# EasyEDA Pro project ADA4530_2025-03-15.epro, board PCB5
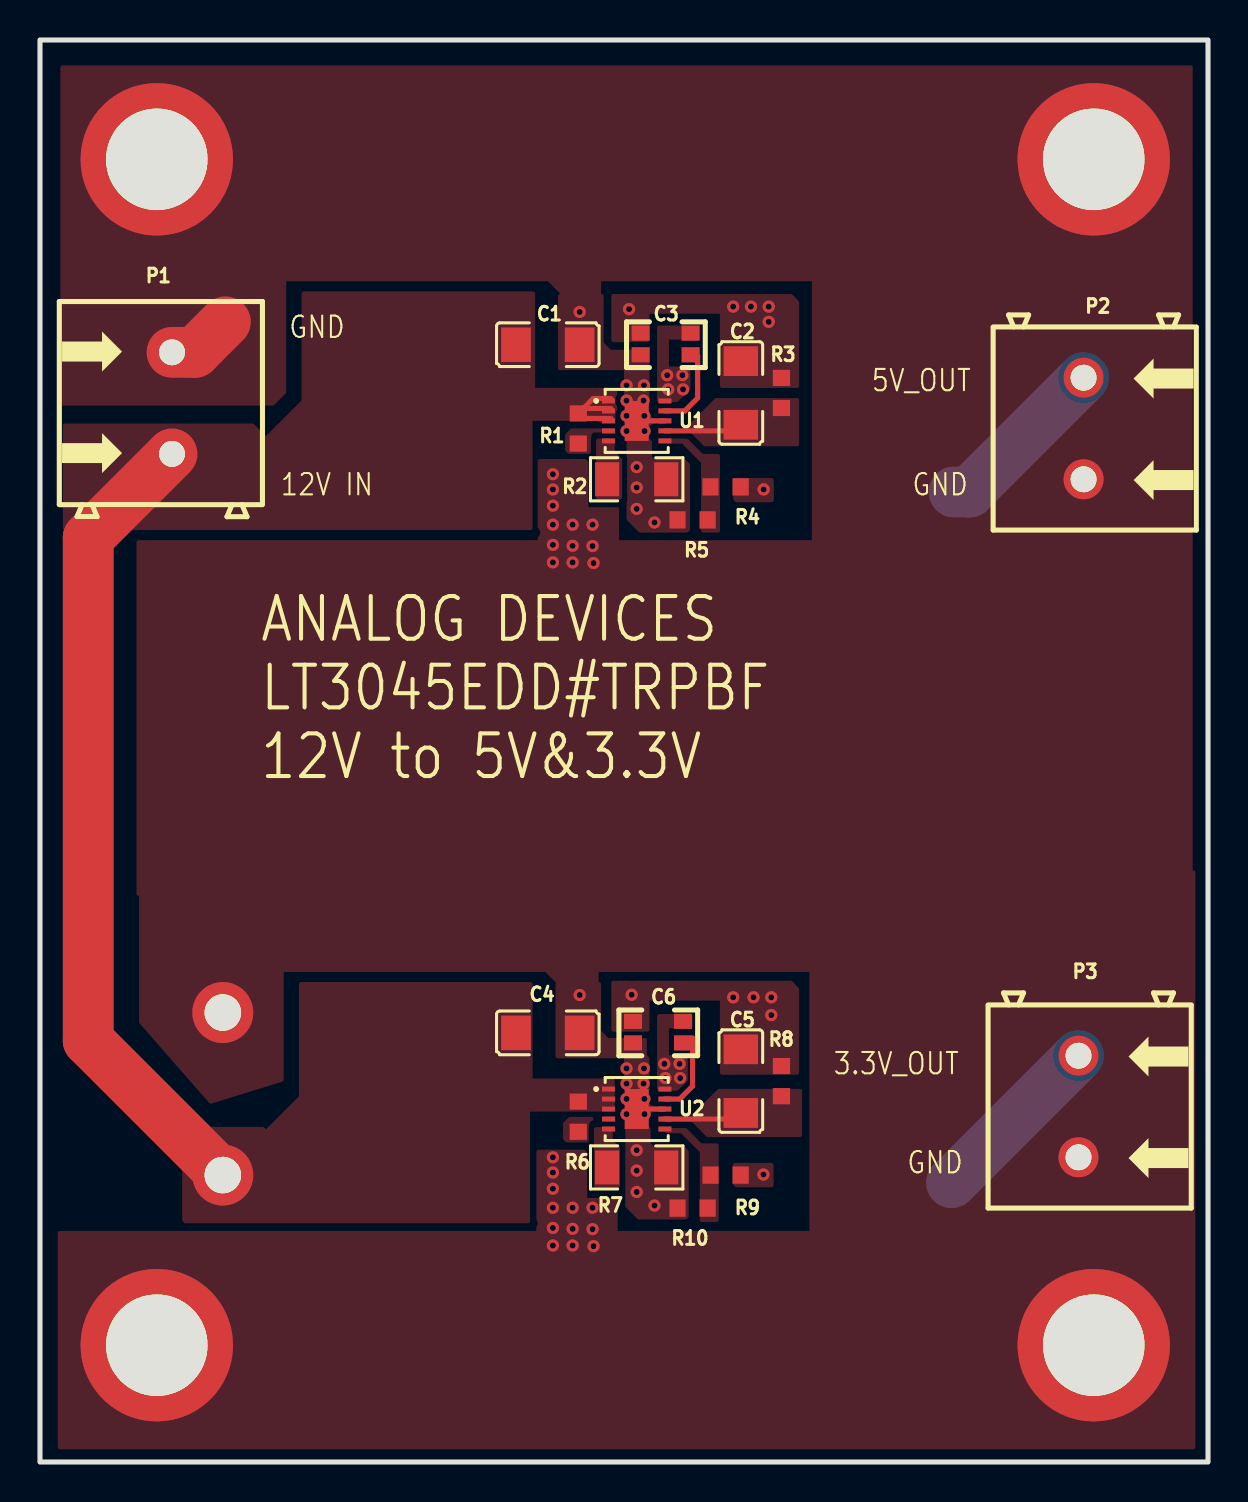
[diagram p6: board, top side]
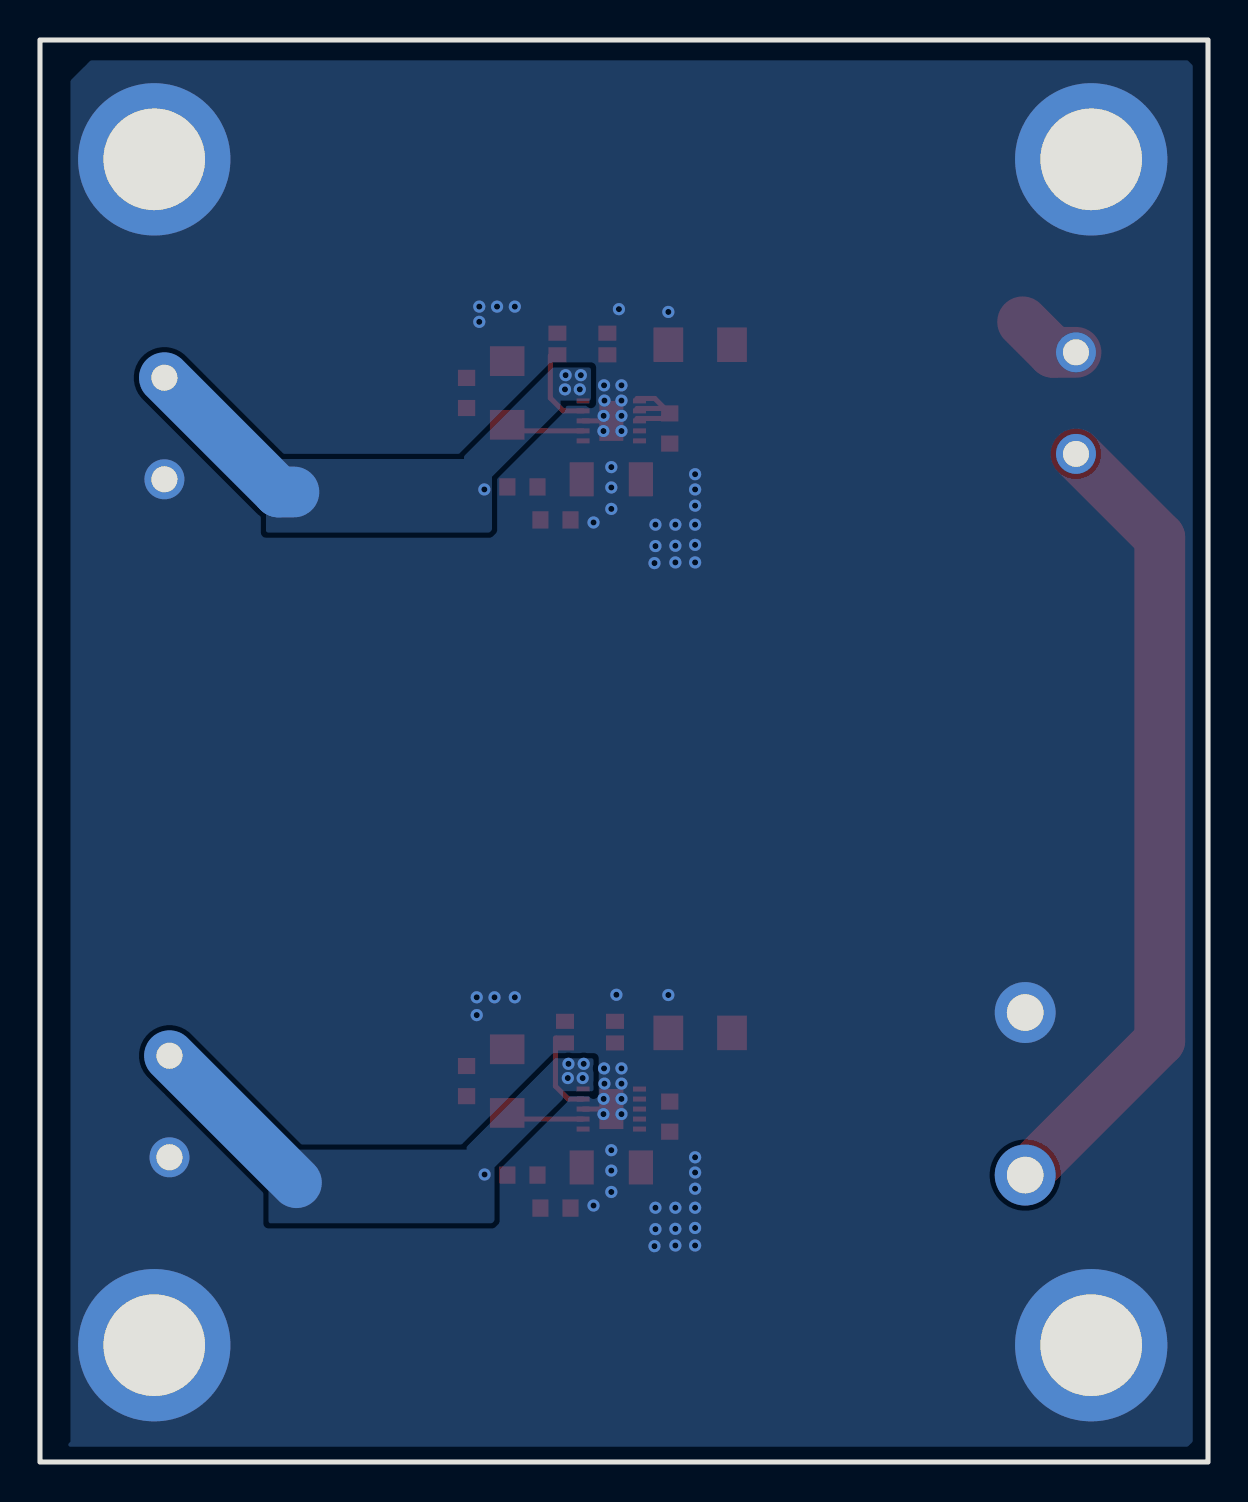
[diagram p7: board, bottom side, seen from below]

Outline 58.42 x 71.12 mm; copper layers: Top Layer, Bottom Layer. Coordinates in mm from the lower left corner of the outline.
Outline path: rectangle 0,71.12 58.42,0
Stack: Top Layer 0.035mm / Dielectric1 1.51mm FR4 er 4.5 / Bottom Layer 0.035mm

## Design rules (mm)
template: 自定义配置
spacing copperThickness1oz (default): track to track 0.102, other pairs 0.152 to 0.3
spacing copperThickness2oz: track to track 0.203, other pairs 0.152 to 0.3
track width copperThickness1oz (default): min 0.127, default 0.254, max 2.54
track width copperThickness2oz: min 0.203, default 0.254, max 2.54
differential pair differentialPair (default): width min 0.127, default 0.254, max 2.54; gap min 0.152, default 0.152
via viaSize (default): diameter min 0.5, default 0.61, max 10; hole min 0.3, default 0.305, max 6.3
net VCC uses 全连接
net GND uses 全连接
net $2N366 uses 全连接
net $2N1218 uses 全连接
net DVDD uses 全连接
net $2N511 uses 全连接
net $2N1220 uses 全连接
net $2N1217 uses 全连接
net $2N394 uses 全连接
net $2N1221 uses 全连接
net $2N525 uses 全连接
net AVDD uses 全连接

## Placement (name value [footprint] x y rotation side)
C1  4.7uF  [C1206]  25.4 55.88 180 top
C2  4.7uF  [C1206]  35.05 53.47 270 top
C3  10uF  [4line-capacitance]  29.59 54.99 0 top
C4  4.7uF  [C1206]  25.4 21.46 180 top
C5  4.7uF  [C1206]  35.05 19.05 270 top
C6  10uF  [4line-capacitance]  29.21 20.57 0 top
NOREF  -  [Pad_e417]  9.14 22.48 0 top
NOREF#2  -  [Pad_e21]  5.84 65.15 0 top
NOREF#3  -  [Pad_e31]  52.7 65.15 0 top
NOREF#4  -  [Pad_e33]  52.7 5.84 0 top
NOREF#5  -  [Pad_e418]  9.14 14.35 0 top
NOREF#6  -  [Pad_e32]  5.84 5.84 0 top
P1  WJ500V-5.08-2P  [CONN-TH_2P-P5.00_WJ500V-5.08-2P]  6.6 52.96 90 top
P2  WJ500V-5.08-2P  [CONN-TH_2P-P5.00_WJ500V-5.08-2P]  52.2 51.69 270 top
P3  WJ500V-5.08-2P  [CONN-TH_2P-P5.00_WJ500V-5.08-2P]  51.94 17.78 270 top
R1  200kΩ  [R0603]  26.92 51.69 90 top
R2  750Ω  [R1206]  29.85 49.15 180 top
R3  33.2kΩ  [R0603]  37.08 53.47 270 top
R4  453kΩ  [R0603]  34.29 48.77 0 top
R5  49.9kΩ  [R0603]  32.64 47.12 0 top
R6  200kΩ  [R0603]  26.92 17.27 90 top
R7  750Ω  [R1206]  29.85 14.73 180 top
R8  49.9kΩ  [R0603]  37.08 19.05 270 top
R9  453kΩ  [R0603]  34.29 14.35 0 top
R10  49.9kΩ  [R0603]  32.64 12.7 0 top
U1  LT3045EDD#TRPBF  [DFN-10_L3.0-W3.0-P0.50-BL-EP]  29.85 52.07 270 top
U2  LT3045EDD#TRPBF  [DFN-10_L3.0-W3.0-P0.50-BL-EP]  29.85 17.65 270 top

## Footprints (pads in the part's own frame, mm; a bottom-side part is the same pattern mirrored in y, then rotated)
4line-capacitance
  rect 0.9x0.754 smd: 1(0.45,1.466) 1(0.45,0.385) 2(2.95,1.466) 2(2.95,0.385)
C1206
  rect 1.485x1.728 smd: 1(-1.593,0) 2(1.593,0)
CONN-TH_2P-P5.00_WJ500V-5.08-2P
  round 2 hole 1.3: 1(-2.54,0) 2(2.54,0)
DFN-10_L3.0-W3.0-P0.50-BL-EP
  rect 0.25x0.65 smd: 1(-1,-1.411) 2(-0.5,-1.411) 3(0,-1.411) 4(0.5,-1.411) 5(1,-1.411) 6(1,1.411) 7(0.5,1.411) 8(0,1.411) 9(-0.5,1.411) 10(-1,1.411)
  rect 2x1.2 smd: 11(0,0)
Pad_e21
  round 7.62 hole 5.08: 1(0,0)
Pad_e31
  round 7.62 hole 5.08: 1(0,0)
Pad_e32
  round 7.62 hole 5.08: 1(0,0)
Pad_e33
  round 7.62 hole 5.08: 1(0,0)
Pad_e417
  round 3.048 hole 1.829: 1(0,0)
Pad_e418
  round 3.048 hole 1.829: 1(0,0)
R0603
  rect 0.806x0.864 smd: 1(-0.753,0) 2(0.753,0)
R1206
  rect 1.208x1.701 smd: 1(-1.479,0) 2(1.479,0)

## Nets
As in the schematic, except:
GND: C1.1 C2.1 C3.1 C4.1 C5.1 C6.1 NOREF.1 NOREF#2.1 NOREF#3.1 NOREF#4.1 NOREF#6.1 P1.2 P2.2 P3.2 R2.1 R3.1 R5.1 R7.1 R8.1 R10.1 U1.8 U1.11 U2.8 U2.11
VCC: C1.2 C4.2 NOREF#5.1 P1.1 R1.2 R6.2 U1.1 U1.2 U1.3 U2.1 U2.2 U2.3

## Via types
v1: diameter 0.61, hole 0.305, Top Layer to Bottom Layer, 70 vias

## Routing (per net, layer and track width the routed paths; a pad name or vN(x,y) marks a point on that pad's centre or on a via; arc(x,y) is an arc through that point)
AVDD: length 13
  Top Layer w0.254: 32.64,21.21 32.64,18.8 32,18.15 U2.9
  Bottom Layer w2.54: 45.59,13.97 51.94,20.32
  vias: v1(31.23,19.91) v1(31.28,19.2) v1(31.99,19.91) v1(32.02,19.2) v1(36.18,14.38)
DVDD: length 13.2
  Top Layer w0.254: C3.2 32.83,55.38 32.89,55.31 32.89,53.21 32.25,52.57 U1.9
  Bottom Layer w2.54: 45.72,48.51 46.48,48.51 P2.1
  vias: v1(31.37,54.36) v1(31.42,53.65) v1(32.13,54.36) v1(32.16,53.65) v1(36.2,48.64)
GND: length 6.1
  Top Layer w0.254: U1.11 U1.8 ; U2.8 U2.11
  Top Layer w2.54: P1.2 7.75,55.5 9.27,57.02
  vias: v1(25.65,49.4) v1(25.65,48.64) v1(25.65,47.83) v1(25.65,46.88) v1(25.65,45.87) v1(25.65,44.99) v1(25.65,15.24) v1(25.65,14.48) v1(25.65,13.67) v1(25.65,12.72) v1(25.65,11.71) v1(25.65,10.83) v1(26.64,46.88) v1(26.64,45.82) v1(26.64,44.99) v1(26.64,12.72) v1(26.64,11.66) v1(26.64,10.83) v1(26.99,57.52) v1(26.99,23.36) v1(27.64,46.88) v1(27.64,45.81) v1(27.69,44.96) v1(27.64,12.72) v1(27.64,11.65) v1(27.69,10.8) v1(29.34,53.85) v1(29.34,53.09) v1(29.34,52.32) v1(29.34,51.56) v1(29.34,19.69) v1(29.34,18.92) v1(29.34,18.16) v1(29.34,17.4) v1(29.46,57.66) v1(29.59,23.37) v1(29.85,49.76) v1(29.85,48.74) v1(29.85,47.67) v1(29.85,15.6) v1(29.85,14.58) v1(29.85,13.51) v1(30.21,53.85) v1(30.19,53.09) v1(30.21,19.69) v1(30.19,18.92) v1(30.23,52.32) v1(30.24,51.56) v1(30.23,18.16) v1(30.24,17.4) v1(30.73,46.99) v1(30.73,12.83) v1(34.67,57.79) v1(34.67,23.24) v1(35.56,57.79) v1(35.69,23.24) v1(36.45,57.79) v1(36.45,57.02) v1(36.58,23.24) v1(36.58,22.35)
VCC: length 45.7
  Top Layer w0.254: 27.18,52.7 27.19,52.69 28.56,52.69 ; 27.18,52.7 R1.2 27.17,52.19 28.56,52.19 ; 27.18,52.7 27.67,53.19 28.56,53.19
  Top Layer w2.54: NOREF#5.1 2.41,21.08 2.41,46.23 P1.1
$2N366: length 3.9
  Top Layer w0.254: U1.7 34.75,51.57 C2.2
$2N1218: length 3.9
  Top Layer w0.254: U2.7 34.75,17.15 C5.2

## Copper pours and planes (outline as drawn; the poured copper is in the pictures)
AVDD on Top Layer: 30.86,18.57 31.88,18.57 32.4,19.07 32.4,20.35 31.46,20.35 31.46,21.69 32.64,21.69 32.64,22.4 30.86,22.4
AVDD on Top Layer: 34.67,14.96 36.62,14.96 36.69,14.89 36.69,13.75 34.79,13.75 34.66,13.87 34.66,14.94
AVDD on Bottom Layer: 30.73,20.19 32.66,20.19 37.08,15.77 37.08,15.62 46.99,15.62 46.99,11.94 35.81,11.94 35.69,12.07 35.69,14.73 32.26,18.16 32.26,18.54 30.86,18.54 30.73,18.42
DVDD on Top Layer: 30.86,53.01 31.88,53.01 32.53,53.63 32.53,54.79 31.46,54.79 31.46,56.13 33.02,56.13 33.02,56.84 30.86,56.84
DVDD on Top Layer: 34.68,49.22 36.63,49.22 36.7,49.15 36.7,48.01 34.8,48.01 34.67,48.13 34.67,49.2
DVDD on Bottom Layer: 30.86,54.74 32.78,54.74 37.21,50.31 37.21,50.17 47.12,50.17 47.12,46.48 35.94,46.48 35.81,46.61 35.81,49.28 32.39,52.71 32.39,53.09 30.99,53.09 30.86,52.96
GND on Top Layer: 29.21,18.7 29.21,20.35 30.35,20.35 30.48,20.23 30.48,18.55 29.36,18.55
GND on Top Layer: 24.83,10.03 24.83,15.62 27.24,15.62 27.37,15.49 27.37,13.21 28.9,13.21 28.9,11.55 29.53,10.92 28.64,10.03
GND on Top Layer: 28.58,58.42 28.58,56.01 30.48,56.01 30.48,57.43 34.01,57.43 34.01,53.72 37.97,53.72 37.97,58.04 37.59,58.42
GND on Top Layer: 1.02,52.83 11.68,52.83 12.32,53.47 12.32,59.06 25.4,59.06 26.04,58.42 25.91,58.29 28.07,58.29 28.07,59.06 38.61,59.06 38.61,46.1 4.83,46.1 4.83,28.32 57.66,28.32 57.66,69.85 1.02,69.85
GND on Top Layer: 29.34,51.18 29.34,47.12 29.97,46.48 32.39,46.48 32.51,46.61 32.51,49.91 32.26,50.17 30.73,50.17 30.61,50.29 30.61,51.05 30.48,51.18
GND on Top Layer: 24.89,44.58 24.89,50.17 27.3,50.17 27.43,50.04 27.43,47.75 28.96,47.75 28.96,46.1 29.59,45.47 28.7,44.58
GND on Top Layer: 25.91,58.42 25.91,54.61 30.35,54.61 30.48,54.74 30.48,55.63 28.55,55.63 28.19,55.98 28.19,58.42
GND on Top Layer: 28.58,24.07 28.58,21.53 30.48,21.53 30.48,23.07 34.01,23.07 34.01,19.37 37.97,19.37 37.97,23.69 37.59,24.07
GND on Top Layer: 25.78,24 25.78,20.19 30.23,20.19 30.35,20.32 30.35,21.21 28.42,21.21 28.07,21.57 28.07,24
GND on Top Layer: 29.21,53.09 29.21,54.74 30.35,54.74 30.48,54.61 30.48,52.93 29.36,52.93
GND on Top Layer: 4.95,21.97 8.51,17.91 12.19,19.05 12.19,24.51 25.27,24.51 25.91,23.88 25.78,23.75 27.94,23.75 27.94,24.51 38.48,24.51 38.48,11.56 0.89,11.56 0.89,0.64 57.79,0.64 57.79,29.59 4.95,29.59
GND on Top Layer: 29.27,16.83 29.27,12.76 29.91,12.13 32.32,12.13 32.45,12.26 32.45,15.56 32.19,15.81 30.67,15.81 30.54,15.94 30.54,16.7 30.42,16.83
GND on Bottom Layer: 1.02,70.1 55.88,70.1 56.9,69.09 56.9,1.02 57.15,0.76 1.02,0.76 0.76,1.02 0.76,69.85
VCC on Top Layer: 7.11,16.76 11.18,16.76 11.3,16.64 12.95,18.29 12.95,24 24.64,24 24.64,19.18 28.75,19.18 28.75,17.61 28.83,17.53 24.51,17.53 24.51,12.07 24.64,11.94 7.24,11.94 7.11,12.07
VCC on Top Layer: 1.14,51.94 10.67,51.94 11.3,51.31 13.08,53.09 13.08,58.55 24.77,58.55 24.77,53.72 28.88,53.72 28.88,52.15 28.96,52.07 24.64,52.07 24.64,46.61 1.14,46.61
$2N366 on Top Layer: 32.33,51.69 32.26,51.69 33.78,53.21 37.97,53.21 37.97,50.8 33.22,50.8
$2N394 on Top Layer: 27.81,51.18 28.75,51.18 28.75,50.53 29.11,50.17 29.11,48.13 27.81,48.13
$2N511 on Top Layer: 28.73,51.7 26.57,51.7 26.26,51.39 26.26,50.57 26.42,50.42 27.58,50.42 27.58,51.39 27.69,51.49 28.73,51.49
$2N525 on Top Layer: 30.86,51.18 32.39,51.18 33.15,50.42 34.01,50.42 34.01,46.51 34.04,46.48 33.07,46.48 33.07,49.98 32.13,50.91 32.13,50.93 31.4,50.93 31.26,51.07 30.97,51.07
$2N1217 on Top Layer: 27.71,16.75 28.65,16.75 28.65,16.1 29.01,15.74 29.01,13.7 27.71,13.7
$2N1218 on Top Layer: 32.47,17.14 32.4,17.14 33.92,18.66 38.11,18.66 38.11,16.25 33.36,16.25
$2N1220 on Top Layer: 28.62,17.26 26.47,17.26 26.16,16.96 26.16,16.14 26.31,15.99 27.48,15.99 27.48,16.96 27.58,17.06 28.62,17.06
$2N1221 on Top Layer: 30.8,16.7 32.32,16.7 33.08,15.94 33.95,15.94 33.95,12.03 33.97,12 33,12 33,15.5 32.07,16.43 32.07,16.45 31.34,16.45 31.19,16.59 30.91,16.59

Small or netless copper shapes (teardrops, artwork), in the pictures only: 14 on Top Layer

## Text on the board
Top Silkscreen Layer: 12V IN | GND | 3.3V_OUT | 5V_OUT | ANALOG DEVICES / LT3045EDD#TRPBF / 12V to 5V&3.3V
